# EAGLE board PWM_Board_77X (EAGLE 7.7.0), part 1 of 2
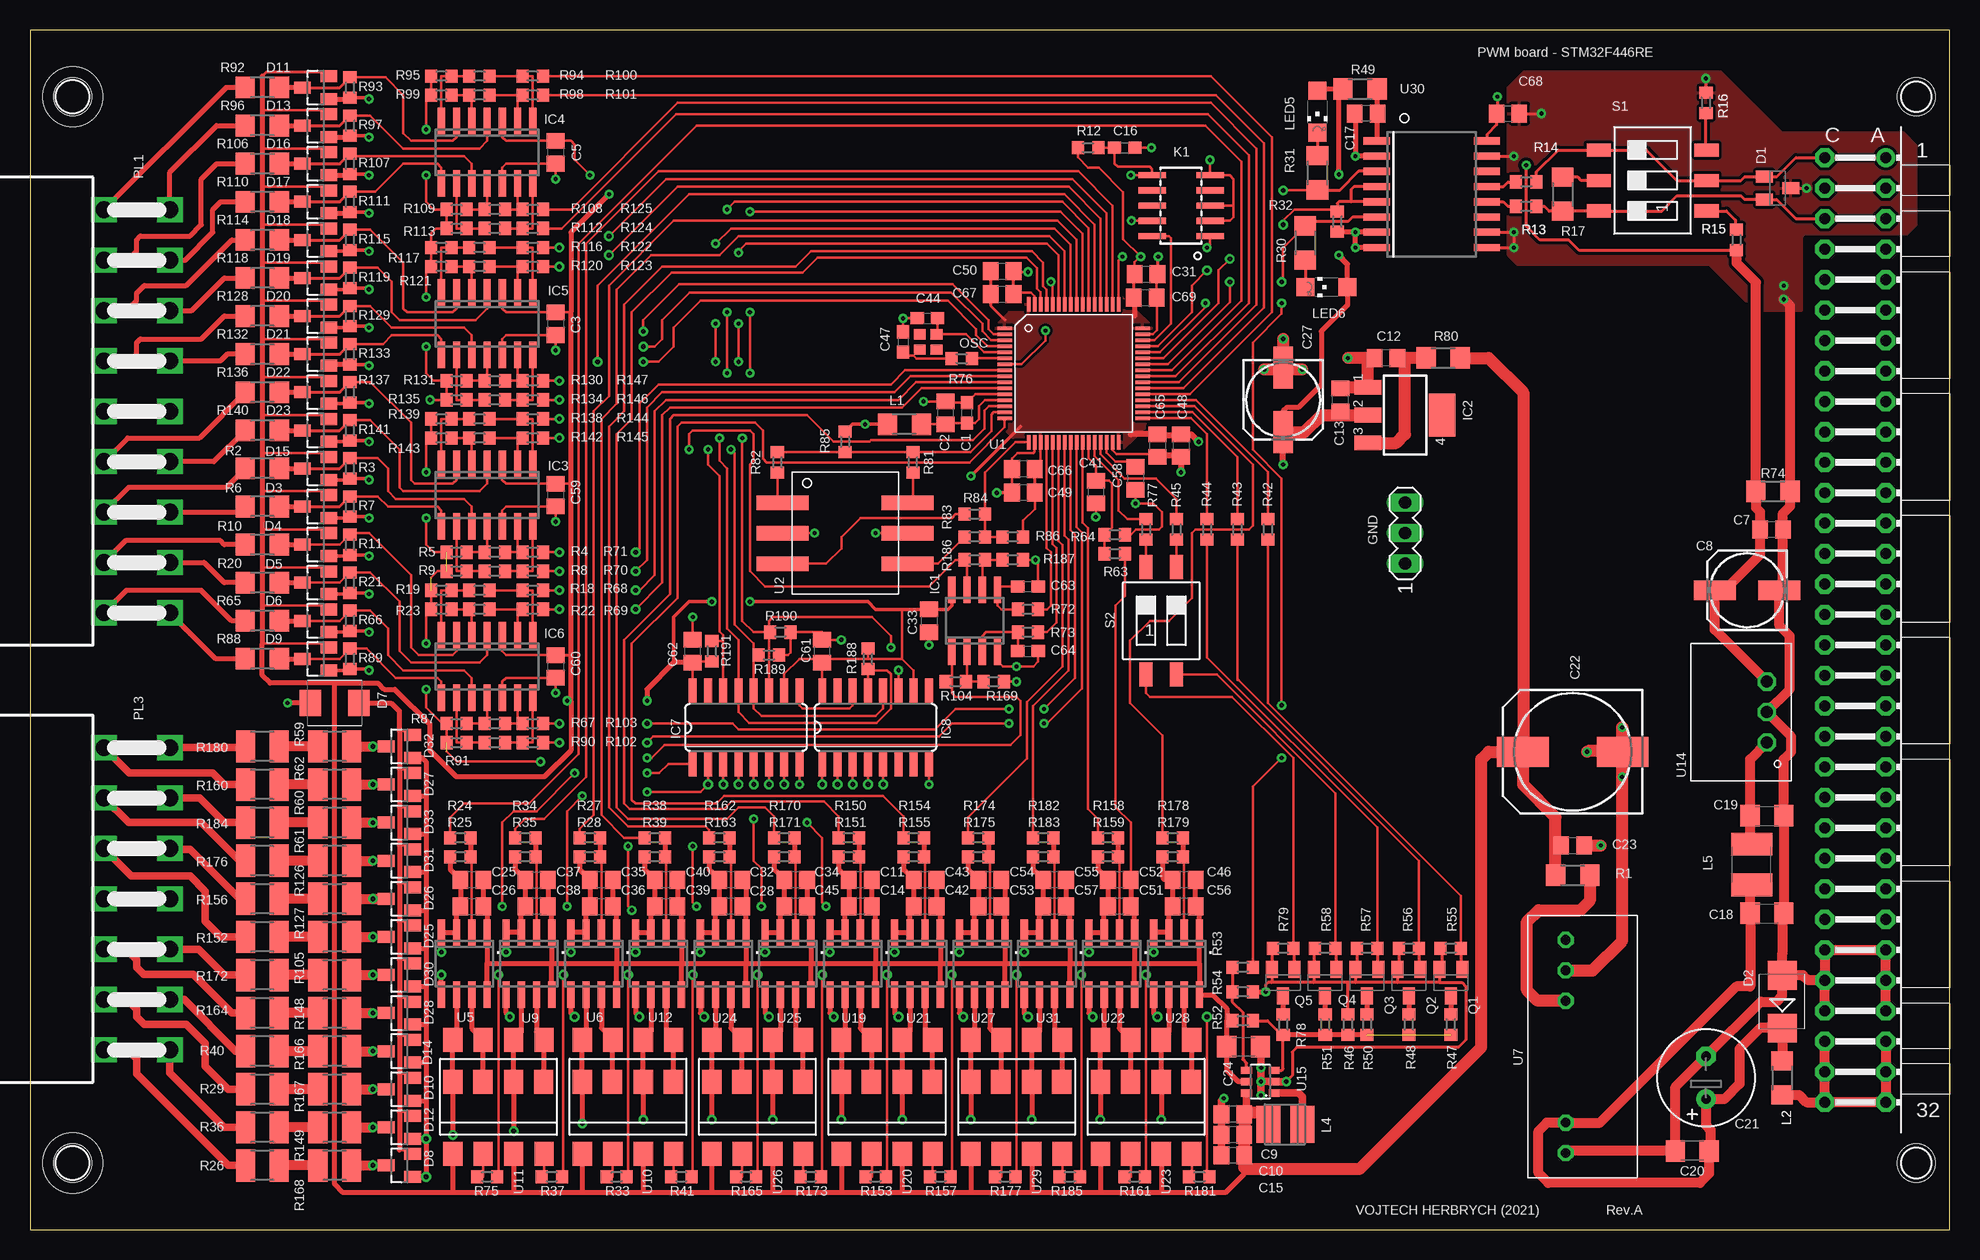
[diagram p8: board, top side]
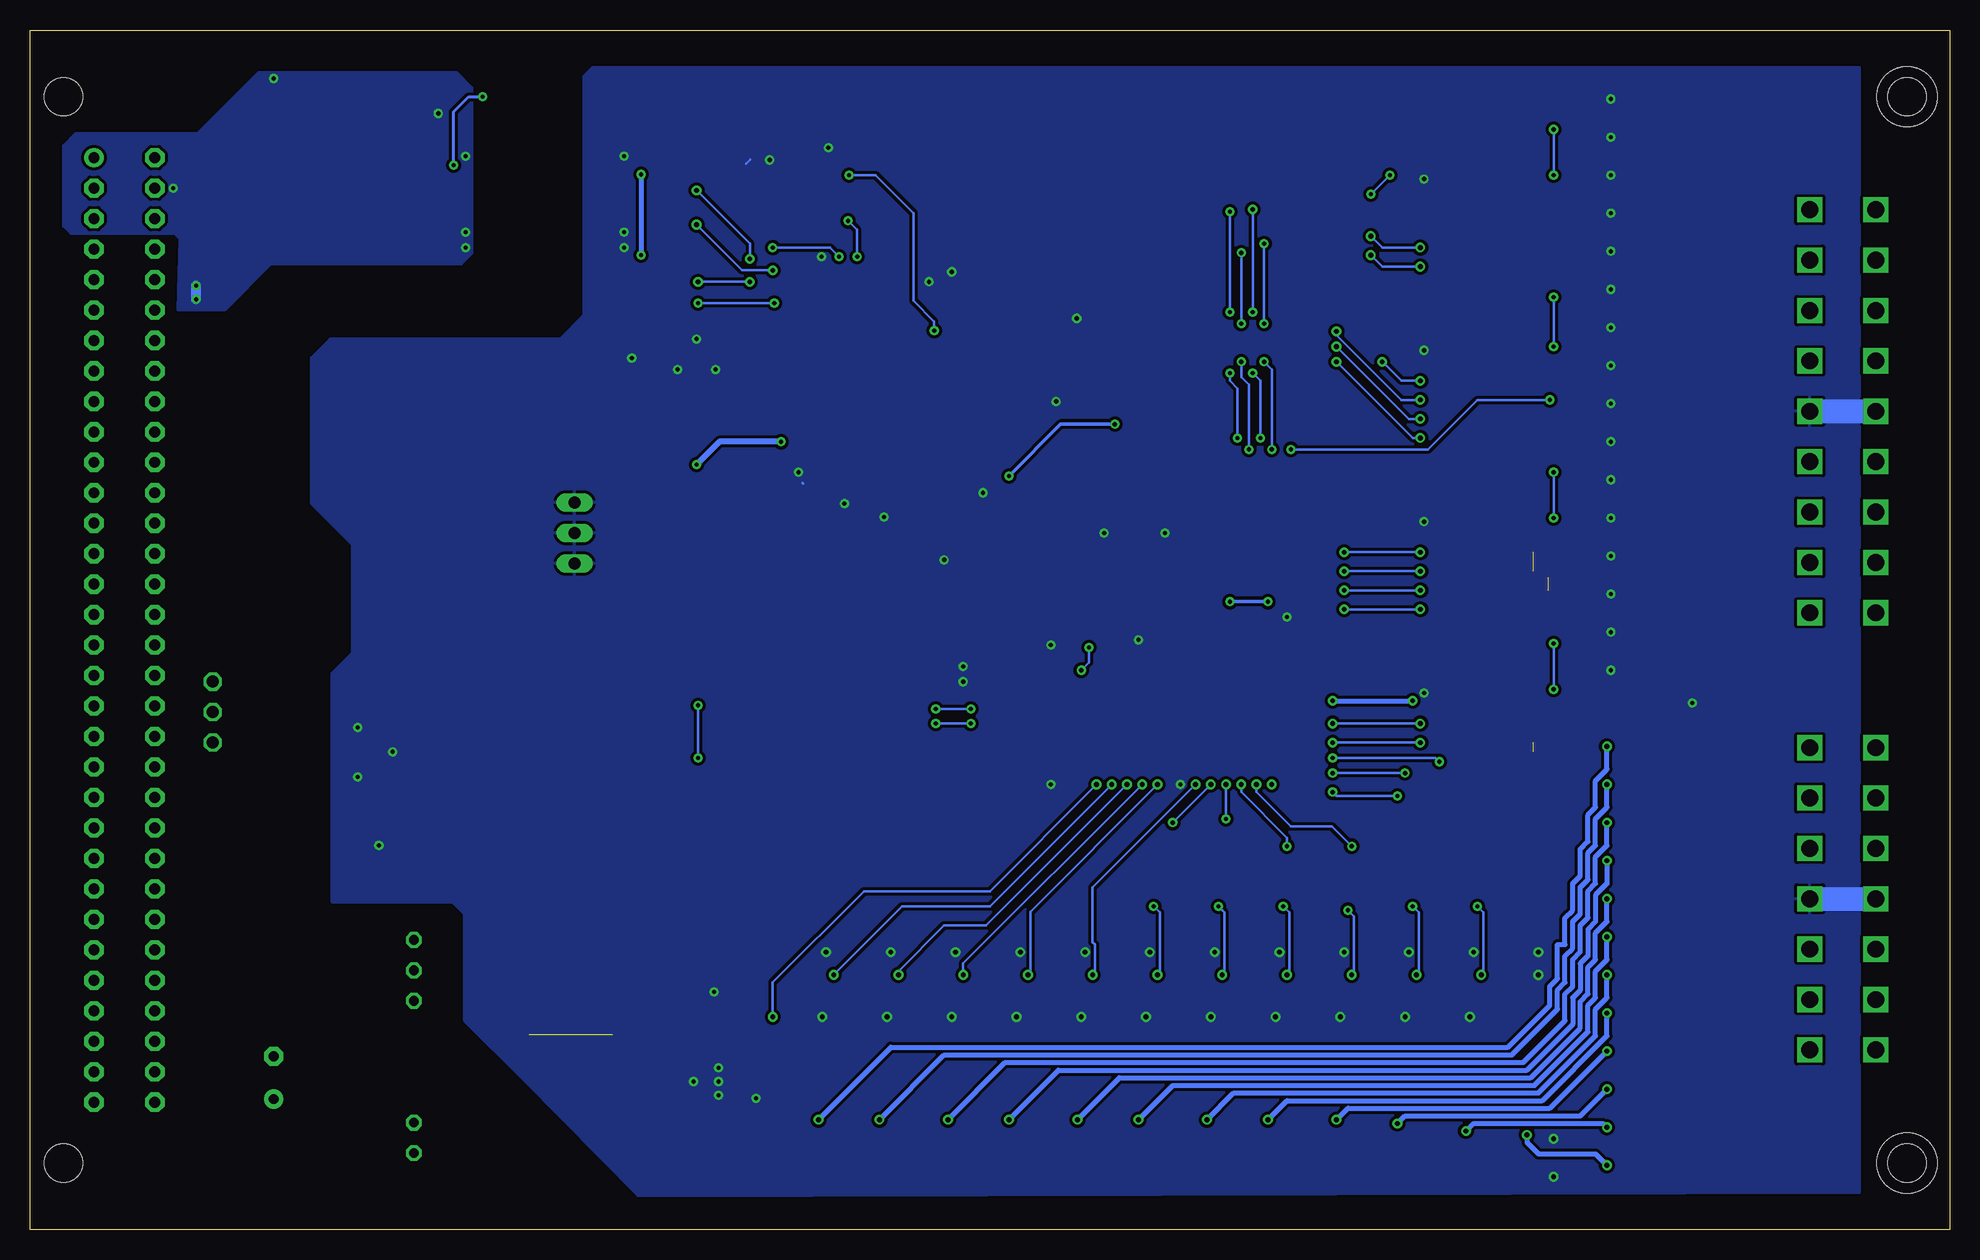
[diagram p9: board, bottom side, seen from below]

Size 160.02 x 100.03 mm. Coordinates in mm from the lower left corner, seen from the top.
Copper layers (1*16): Top 0.035mm / dielectric 1.5mm / Bottom 0.035mm
Design rules "default *": minimum track width 6mil, minimum drill 0.35mm, track to track 6mil, track to pad 6mil, pad to pad 6mil, via to via 6mil, smd to smd 6mil, copper to edge 40mil, drill to drill 6mil, minimum pad ring 10mil, minimum via ring 8mil, stop-mask expansion 4mil, vias tented up to drill 0mil, thermal gap 10mil
Holes 3.17 mm at 3.56,5.56 3.56,94.46 157.23,94.46 157.23,5.56
Holes 5 mm at 3.56,5.56 3.56,94.46
tRestrict: 15 lines
bRestrict: 15 lines

## Footprints (pad centres in the part's own frame; a part is rotated, then mirrored left to right if it is on the bottom)
C0603 = smd 1.1 x 1: 1 -0.85,0; 2 0.85,0
C0805 = smd 1.3 x 1.5: 1 -0.95,0; 2 0.95,0
153CLV-0605 = smd 3.5 x 1.6: + 2.7,0; - -2.7,0
C1206 = smd 1.6 x 1.8: 1 -1.4,0; 2 1.4,0
E3,5-8 = drill 0.813 pad 1.6: + -1.778,0 | drill 0.813 pad 1.6 octagon: - 1.778,0
150CLZ-1014 = smd 4.3 x 2.5: + 4.15,0; - -4.15,0
SOT23-BEC = smd 1 x 1.4: B -0.95,-1.1; C 0,1.1; E 0.95,-1.1
SMB = smd 2.4 x 2.4: A 2.2,0; C -2.2,0
SOT23 = smd 1 x 1.4: 1 -0.95,-1.1; 2 0.95,-1.1; 3 0,1.1
SMBJ = smd 1.78 x 2.16: A 2.04,0; C -2.03,0
MA03-1 = drill 1.016 long: 1 -2.54,0; 2 0,0; 3 2.54,0
SO8 = smd 0.6 x 2.2: 1 -1.905,-2.6; 2 -0.635,-2.6; 3 0.635,-2.6; 4 1.905,-2.6; 5 1.905,2.6; 6 0.635,2.6; 7 -0.635,2.6; 8 -1.905,2.6
SOT223 = smd 1.219 x 2.235: 1 -2.311,-3.099; 2 0,-3.099; 3 2.311,-3.099 | smd 3.6 x 2.2: 4 0,3.099
SO14 = smd 0.6 x 2.2: 1 -3.81,-2.6; 2 -2.54,-2.6; 3 -1.27,-2.6; 4 0,-2.6; 5 1.27,-2.6; 6 2.54,-2.6; 7 3.81,-2.6; 8 3.81,2.6; 9 2.54,2.6; 10 1.27,2.6; 11 0,2.6; 12 -1.27,2.6; 13 -2.54,2.6; 14 -3.81,2.6
SO16 = smd 0.66 x 2.032: 1 -4.445,-3.073; 2 -3.175,-3.073; 3 -1.905,-3.073; 4 -0.635,-3.073; 5 0.635,-3.073; 6 1.905,-3.073; 7 3.175,-3.073; 8 4.445,-3.073; 9 4.445,3.073; 10 3.175,3.073; 11 1.905,3.073; 12 0.635,3.073; 13 -0.635,3.073; 14 -1.905,3.073; 15 -3.175,3.073; 16 -4.445,3.073
SAMTECH_FTSH-105-01 = smd 0.508 x 2.286: 1 -2.54,-2.413; 2 -2.54,2.413; 3 -1.27,-2.413; 4 -1.27,2.413; 5 0,-2.413; 6 0,2.413; 7 1.27,-2.413; 8 1.27,2.413; 9 2.54,-2.413; 10 2.54,2.413
VG64P = drill 0.914 pad 1.6: A1 154.94,39.37 | drill 0.914 pad 1.6 octagon: A2 154.94,36.83; A3 154.94,34.29; A4 154.94,31.75; A5 154.94,29.21; A6 154.94,26.67; A7 154.94,24.13; A8 154.94,21.59; A9 154.94,19.05; A10 154.94,16.51; A11 154.94,13.97; A12 154.94,11.43; A13 154.94,8.89; A14 154.94,6.35; A15 154.94,3.81; A16 154.94,1.27; A17 154.94,-1.27; A18 154.94,-3.81; A19 154.94,-6.35; A20 154.94,-8.89; A21 154.94,-11.43; A22 154.94,-13.97; A23 154.94,-16.51; A24 154.94,-19.05; A25 154.94,-21.59; A26 154.94,-24.13; A27 154.94,-26.67; A28 154.94,-29.21; A29 154.94,-31.75; A30 154.94,-34.29; A31 154.94,-36.83; A32 154.94,-39.37; C1 149.86,39.37; C2 149.86,36.83; C3 149.86,34.29; C4 149.86,31.75; C5 149.86,29.21; C6 149.86,26.67; C7 149.86,24.13; C8 149.86,21.59; C9 149.86,19.05; C10 149.86,16.51; C11 149.86,13.97; C12 149.86,11.43; C13 149.86,8.89; C14 149.86,6.35; C15 149.86,3.81; C16 149.86,1.27; C17 149.86,-1.27; C18 149.86,-3.81; C19 149.86,-6.35; C20 149.86,-8.89; C21 149.86,-11.43; C22 149.86,-13.97; C23 149.86,-16.51; C24 149.86,-19.05; C25 149.86,-21.59; C26 149.86,-24.13; C27 149.86,-26.67; C28 149.86,-29.21; C29 149.86,-31.75; C30 149.86,-34.29; C31 149.86,-36.83; C32 149.86,-39.37
R1206 = smd 1.6 x 1.803: 1 -1.422,0; 2 1.422,0
IND_NPI43C = smd 2 x 3.07: 1 -1.365,0; 2 1.492,0
L1812 = smd 1.9 x 3.4: 1 -1.696,0; 2 1.696,0
CHIPLED_1206 = smd 1.5 x 1.5: A 0,-1.75; C 0,1.75
OSCILATOR = smd 0.965 x 0.864: 1 -0.762,-0.635; 2 0.635,-0.635; 3 0.635,0.635; 4 -0.762,0.635
5569-18_NO_HOLES = drill 1.4 square: 1 16.8,0; 2 12.6,0; 3 8.4,0; 4 4.2,0; 5 0,0; 6 -4.2,0; 7 -8.4,0; 8 -12.6,0; 9 -16.8,0; 10 16.8,5.5; 11 12.6,5.5; 12 8.4,5.5; 13 4.2,5.5; 14 0,5.5; 15 -4.2,5.5; 16 -8.4,5.5; 17 -12.6,5.5; 18 -16.8,5.5
5569-14_NO_HOLES = drill 1.4 square: 1 12.6,0; 2 8.4,0; 3 4.2,0; 4 0,0; 5 -4.2,0; 6 -8.4,0; 7 -12.6,0; 8 12.6,5.5; 9 8.4,5.5; 10 4.2,5.5; 11 0,5.5; 12 -4.2,5.5; 13 -8.4,5.5; 14 -12.6,5.5
R0603 = smd 1 x 1.1: 1 -0.85,0; 2 0.85,0
R1210 = smd 1.6 x 2.7: 1 -1.4,0; 2 1.4,0
SMS-003 = smd 1.092 x 2.007: 1 -2.54,-4.496; 2 0,-4.496; 3 2.54,-4.496; 4 2.54,4.496; 5 0,4.496; 6 -2.54,4.496
SMS-002 = smd 1.092 x 2.007: 1 -1.27,-4.496; 2 1.27,-4.496; 3 1.27,4.496; 4 -1.27,4.496
LQFP64_F446RE = smd 0.3 x 1.2: 1 -3.75,-5.75; 2 -3.25,-5.75; 3 -2.75,-5.75; 4 -2.25,-5.75; 5 -1.75,-5.75; 6 -1.25,-5.75; 7 -0.75,-5.75; 8 -0.25,-5.75; 9 0.25,-5.75; 10 0.75,-5.75; 11 1.25,-5.75; 12 1.75,-5.75; 13 2.25,-5.75; 14 2.75,-5.75; 15 3.25,-5.75; 16 3.75,-5.75; 33 3.75,5.75; 34 3.25,5.75; 35 2.75,5.75; 36 2.25,5.75; 37 1.75,5.75; 38 1.25,5.75; 39 0.75,5.75; 40 0.25,5.75; 41 -0.25,5.75; 42 -0.75,5.75; 43 -1.25,5.75; 44 -1.75,5.75; 45 -2.25,5.75; 46 -2.75,5.75; 47 -3.25,5.75; 48 -3.75,5.75 | smd 1.2 x 0.3: 17 5.75,-3.75; 18 5.75,-3.25; 19 5.75,-2.75; 20 5.75,-2.25; 21 5.75,-1.75; 22 5.75,-1.25; 23 5.75,-0.75; 24 5.75,-0.25; 25 5.75,0.25; 26 5.75,0.75; 27 5.75,1.25; 28 5.75,1.75; 29 5.75,2.25; 30 5.75,2.75; 31 5.75,3.25; 32 5.75,3.75; 49 -5.75,3.75; 50 -5.75,3.25; 51 -5.75,2.75; 52 -5.75,2.25; 53 -5.75,1.75; 54 -5.75,1.25; 55 -5.75,0.75; 56 -5.75,0.25; 57 -5.75,-0.25; 58 -5.75,-0.75; 59 -5.75,-1.25; 60 -5.75,-1.75; 61 -5.75,-2.25; 62 -5.75,-2.75; 63 -5.75,-3.25; 64 -5.75,-3.75
HEX_DEC = smd 1.219 x 4.318: 1 2.54,5.842; 2 -2.54,-4.572; 4 -2.54,5.842; 8 2.54,-4.572; C1 0,5.842; C2 0,-4.572
SO08 = smd 0.6 x 2.2: 1 -1.905,-2.6; 2 -0.635,-2.6; 3 0.635,-2.6; 4 1.905,-2.6; 5 1.905,2.6; 6 0.635,2.6; 7 -0.635,2.6; 8 -1.905,2.6
IU2405SA = drill 0.8 octagon: NC 10.541,0; VIN+ -4.699,0; VIN- -7.239,0; VOUT+ 5.461,0; VOUT- 8.001,0
DIL8-SMD_V2 = smd 1.6 x 2: 1 -3.81,-4.77; 2 -1.27,-4.77; 3 1.27,-4.77; 4 3.81,-4.77; 5 3.81,4.77; 6 1.27,4.77; 7 -1.27,4.77; 8 -3.81,4.77; 9 -3.81,1.27; 10 -1.31,1.27; 11 1.27,1.27; 12 3.77,1.27
R-78E-0.5 = drill 1 octagon: 1 -2.54,0; 2 0,0; 3 2.54,0
SOT23-6 = smd 0.6 x 0.9: 1 -0.95,-1.15; 2 0,-1.15; 3 0.95,-1.15; 4 0.95,1.15; 5 0,1.15; 6 -0.95,1.15
SO-16DW = smd 0.6 x 2.2: 1 -4.445,-4.6; 2 -3.175,-4.6; 3 -1.905,-4.6; 4 -0.635,-4.6; 5 0.635,-4.6; 6 1.905,-4.6; 7 3.175,-4.6; 8 4.445,-4.6; 9 4.445,4.6; 10 3.175,4.6; 11 1.905,4.6; 12 0.635,4.6; 13 -0.635,4.6; 14 -1.905,4.6; 15 -3.175,4.6; 16 -4.445,4.6

## Placement (x,y rotation side)
C1  220p  [C0603]  78.11,68.11 90 top
C2  1u  [C0805]  76.33,68.11 90 top
C3  100n  [C0805]  43.81,75.54 270 top
C5  100n  [C0805]  43.81,89.83 270 top
C7  100n  [C0805]  145.16,58.39 0 top
C8  100u  [153CLV-0605]  143.13,53.31 180 top
C9  1u/16V  [C0805]  100.27,9.63 180 top
C10  1u/16V  [C0805]  100.27,7.91 180 top
C11  100n  [C0805]  69.22,29.18 180 top
C12  100n  [C0805]  113.03,72.68 180 top
C13  100n  [C0805]  109.22,69.19 90 top
C14  100n  [C0805]  69.22,26.96 180 top
C15  1u/16V  [C0805]  100.27,6.2 180 top
C16  100n  [C0603]  91.25,90.21 0 top
C17  100n  [C0805]  111.38,93.07 180 top
C18  10u  [C1206]  144.78,26.39 0 top
C19  10u  [C1206]  144.78,34.52 0 top
C20  100n  [C1206]  138.56,6.58 180 top
C21  47u  [E3,5-8]  139.7,12.67 90 top
C22  47u  [150CLZ-1014]  128.59,39.85 180 top
C23  100n  [C0805]  128.59,32.04 0 top
C24  10u/50V  [C1206]  101.16,15.28 0 top
C25  100n  [C0805]  36.83,29.18 180 top
C26  100n  [C0805]  36.83,26.96 0 top
C27  100u  [153CLV-0605]  104.46,69.19 270 top
C28  100n  [C0805]  58.42,26.96 180 top
C31  1u  [C0805]  93.03,79.67 0 top
C32  100n  [C0805]  58.42,29.18 180 top
C33  100n  [C0805]  74.93,50.77 270 top
C34  100n  [C0805]  63.82,29.18 180 top
C35  100n  [C0805]  47.62,29.18 180 top
C36  100n  [C0805]  47.62,26.96 0 top
C37  100n  [C0805]  42.23,29.18 0 top
C38  100n  [C0805]  42.23,26.96 180 top
C39  100n  [C0805]  53.02,26.96 0 top
C40  100n  [C0805]  53.02,29.18 180 top
C41  100n  [C0805]  88.84,61.51 270 top
C42  100n  [C0805]  74.61,26.96 180 top
C43  100n  [C0805]  74.61,29.18 180 top
C44  10p  [C0603]  74.8,75.98 0 top
C45  100n  [C0805]  63.82,26.96 180 top
C46  100n  [C0805]  96.2,29.18 180 top
C47  10p  [C0603]  72.77,74.02 270 top
C48  1u  [C0805]  95.95,65.38 270 top
C49  1u  [C0805]  82.8,61.44 180 top
C50  1u  [C0805]  81.03,79.92 0 top
C51  100n  [C0805]  90.81,26.96 180 top
C52  100n  [C0805]  90.81,29.18 180 top
C53  100n  [C0805]  80.01,26.96 180 top
C54  100n  [C0805]  80.01,29.18 180 top
C55  100n  [C0805]  85.41,29.18 180 top
C56  100n  [C0805]  96.2,26.96 180 top
C57  100n  [C0805]  85.41,26.96 180 top
C58  4u7  [C0805]  92.14,62.65 270 top
C59  100n  [C0805]  43.81,61.25 270 top
C60  100n  [C0805]  43.81,46.96 270 top
C61  100n  [C0805]  66.04,48.23 90 top
C62  100n  [C0805]  55.24,48.23 90 top
C63  NC  [C0603]  83.19,53.63 0 top
C64  NC  [C0603]  83.19,48.23 0 top
C65  100n  [C0805]  93.98,65.38 270 top
C66  100n  [C0805]  82.8,63.41 180 top
C67  100n  [C0805]  81.03,78.02 0 top
C68  100n  [C0805]  123.19,93.07 0 top
C69  100n  [C0805]  92.96,77.7 0 top
D1  SM712-02HTG  [SOT23-BEC]  145.67,86.84 270 top
D2  SMBJ26A  [SMB]  146.05,19.02 90 top
D3  BAV199  [SOT23]  23.81,60.3 90 top
D4  BAV199  [SOT23]  23.81,57.12 90 top
D5  BAV199  [SOT23]  23.81,53.95 90 top
D6  BAV199  [SOT23]  23.81,50.77 90 top
D7  SMBJ24A  [SMBJ]  25.4,43.92 180 top
D8  BAV199  [SOT23]  30.8,5.37 90 top
D9  BAV199  [SOT23]  23.81,47.6 90 top
D10  BAV199  [SOT23]  30.8,11.72 90 top
D11  BAV199  [SOT23]  23.81,95.22 90 top
D12  BAV199  [SOT23]  30.8,8.55 90 top
D13  BAV199  [SOT23]  23.81,92.05 90 top
D14  BAV199  [SOT23]  30.8,14.9 90 top
D15  BAV199  [SOT23]  23.81,63.47 90 top
D16  BAV199  [SOT23]  23.81,88.87 90 top
D17  BAV199  [SOT23]  23.81,85.7 90 top
D18  BAV199  [SOT23]  23.81,82.52 90 top
D19  BAV199  [SOT23]  23.81,79.35 90 top
D20  BAV199  [SOT23]  23.81,76.17 90 top
D21  BAV199  [SOT23]  23.81,73 90 top
D22  BAV199  [SOT23]  23.81,69.82 90 top
D23  BAV199  [SOT23]  23.81,66.65 90 top
D25  BAV199  [SOT23]  30.8,24.42 90 top
D26  BAV199  [SOT23]  30.8,27.6 90 top
D27  BAV199  [SOT23]  30.8,37.12 90 top
D28  BAV199  [SOT23]  30.8,18.07 90 top
D30  BAV199  [SOT23]  30.8,21.25 90 top
D31  BAV199  [SOT23]  30.8,30.77 90 top
D32  BAV199  [SOT23]  30.8,40.3 90 top
D33  BAV199  [SOT23]  30.8,33.95 90 top
GND  [MA03-1]  114.62,58.08 90 top
IC1  MCP6002  [SO8]  78.74,50.77 0 top
IC2  LD1117  [SOT223]  114.62,67.92 270 top
IC3  TLC3704  [SO14]  38.1,61.25 180 top
IC4  TLC3704  [SO14]  38.1,89.83 180 top
IC5  TLC3704  [SO14]  38.1,75.54 180 top
IC6  TLC3704  [SO14]  38.1,46.96 180 top
IC7  74HCT595D  [SO16]  59.69,41.88 0 top
IC8  74HTC595D  [SO16]  70.48,41.88 0 top
K1  FTS-105-01-L-DV  [SAMTECH_FTSH-105-01]  95.95,85.38 90 top
K2  09 03 364 6921  [VG64P]  -0.25,50.01 0 top
L1  [R1206]  72.9,67.16 0 top
L2  LQM31PN1R0M00L  [R1206]  146.05,12.67 90 top
L4  SDR0302-120ML  [IND_NPI43C]  104.58,8.8 0 top
L5  1008PS-392KLB  [L1812]  143.51,30.45 90 top
LED5  1206  [CHIPLED_1206]  107.31,93.19 180 top
LED6  1206  [CHIPLED_1206]  108.08,78.59 90 top
OSC  Q22FA12800249  [OSCILATOR]  74.8,74.02 180 top
PL1  [5569-18_NO_HOLES]  6.16,68.24 270 top
PL3  [5569-14_NO_HOLES]  6.16,27.6 270 top
Q1  BC817  [SOT23-BEC]  118.43,20.61 180 top
Q2  BC817  [SOT23-BEC]  114.94,20.61 180 top
Q3  BC817  [SOT23-BEC]  111.44,20.61 180 top
Q4  BC817  [SOT23-BEC]  107.95,20.61 180 top
Q5  BC817  [SOT23-BEC]  104.46,20.61 180 top
R1  0R1  [R1206]  128.59,29.57 180 top
R2  10k  [R1206]  19.37,63.47 0 top
R3  2k58  [R0603]  26.67,63.47 90 top
R4  330k  [R0603]  38.73,56.49 180 top
R5  3k3  [R0603]  35.56,56.49 0 top
R6  10k  [R1206]  19.37,60.3 0 top
R7  2k58  [R0603]  26.67,60.3 90 top
R8  330k  [R0603]  38.73,54.9 180 top
R9  3k3  [R0603]  35.56,54.9 0 top
R10  10k  [R1206]  19.37,57.12 0 top
R11  2k58  [R0603]  26.67,57.12 90 top
R12  10k  [R0603]  88.2,90.21 180 top
R13  10R  [R0603]  124.71,85.32 180 top
R14  10R  [R0603]  124.71,87.35 180 top
R15  1k  [R0603]  142.24,82.52 270 top
R16  1k  [R0603]  139.7,93.95 270 top
R17  130R  [R1206]  127.76,86.33 90 top
R18  330k  [R0603]  37.47,53.31 180 top
R19  3k3  [R0603]  34.29,53.31 0 top
R20  10k  [R1206]  19.37,53.95 0 top
R21  2k58  [R0603]  26.67,53.95 90 top
R22  330k  [R0603]  37.47,51.73 180 top
R23  3k3  [R0603]  34.29,51.73 0 top
R24  10k  [R0603]  35.88,32.68 0 top
R25  100k  [R0603]  35.88,31.09 0 top
R26  330R  [R1210]  19.37,5.37 180 top
R27  10k  [R0603]  46.67,32.68 0 top
R28  100k  [R0603]  46.67,31.09 0 top
R29  330R  [R1210]  19.37,11.72 180 top
R30  1k5  [R1206]  106.3,82.27 90 top
R31  1k5  [R1206]  107.31,88.11 270 top
R32  10k  [R0603]  108.97,84.05 90 top
R33  680R  [R0603]  48.9,4.42 0 top
R34  10k  [R0603]  41.27,32.68 0 top
R35  100k  [R0603]  41.27,31.09 0 top
R36  330R  [R1210]  19.37,8.55 180 top
R37  680R  [R0603]  43.5,4.42 0 top
R38  10k  [R0603]  52.07,32.68 0 top
R39  100k  [R0603]  52.07,31.09 0 top
R40  330R  [R1210]  19.37,14.9 180 top
R41  680R  [R0603]  54.29,4.42 0 top
R42  10k  [R0603]  103.19,58.39 270 top
R43  10k  [R0603]  100.65,58.39 270 top
R44  10k  [R0603]  98.11,58.39 270 top
R45  10k  [R0603]  95.57,58.39 270 top
R46  240k  [R0603]  109.86,17.12 270 top
R47  120k  [R0603]  118.43,17.12 270 top
R48  60k  [R0603]  114.94,17.12 270 top
R49  0R1  [R1206]  110.87,95.1 180 top
R50  30k  [R0603]  111.44,17.12 270 top
R51  15k  [R0603]  107.95,17.12 270 top
R52  113k  [R0603]  101.09,17.44 180 top
R53  0R  [R0603]  101.09,21.88 0 top
R54  10k  [R0603]  101.09,19.85 0 top
R55  10k  [R0603]  118.43,23.47 180 top
R56  10k  [R0603]  114.94,23.47 180 top
R57  10k  [R0603]  111.44,23.47 180 top
R58  10k  [R0603]  107.95,23.47 180 top
R59  330R  [R1210]  25.4,40.3 180 top
R60  330R  [R1210]  25.4,33.95 180 top
R61  330R  [R1210]  25.4,30.77 180 top
R62  330R  [R1210]  25.4,37.12 180 top
R63  22k  [R0603]  90.42,56.36 0 top
R64  2k  [R0603]  90.42,57.95 180 top
R65  10k  [R1206]  19.37,50.77 0 top
R66  2k58  [R0603]  26.67,50.77 90 top
R67  330k  [R0603]  38.73,42.2 180 top
R68  0R  [R0603]  41.91,53.31 180 top
R69  0R  [R0603]  41.91,51.73 180 top
R70  0R  [R0603]  41.91,54.9 180 top
R71  0R  [R0603]  41.91,56.49 180 top
R72  0R  [R0603]  83.19,51.73 180 top
R73  0R  [R0603]  83.19,49.82 180 top
R74  470R  [R1206]  145.29,61.57 180 top
R75  680R  [R0603]  38.1,4.42 0 top
R76  390R  [R0603]  77.66,72.62 180 top
R77  10k  [R0603]  93.03,58.39 270 top
R78  7k5  [R0603]  104.46,17.12 270 top
R79  10k  [R0603]  104.46,23.47 180 top
R80  0R1  [R1206]  117.79,72.68 180 top
R81  20k  [R0603]  73.6,63.98 270 top
R82  10k  [R0603]  62.29,63.98 270 top
R83  20k  [R0603]  78.74,57.76 180 top
R84  10k  [R0603]  78.74,59.66 180 top
R85  10k  [R0603]  67.94,65.7 270 top
R86  10k  [R0603]  81.92,57.76 180 top
R87  3k3  [R0603]  35.56,42.2 0 top
R88  10k  [R1206]  19.37,47.6 0 top
R89  2k58  [R0603]  26.67,47.6 90 top
R90  330k  [R0603]  38.73,40.61 180 top
R91  3k3  [R0603]  35.56,40.61 0 top
R92  10k  [R1206]  19.37,95.22 0 top
R93  2k58  [R0603]  26.67,95.22 90 top
R94  330k  [R0603]  37.47,96.18 180 top
R95  3k3  [R0603]  34.29,96.18 0 top
R96  10k  [R1206]  19.37,92.05 0 top
R97  2k58  [R0603]  26.67,92.05 90 top
R98  330k  [R0603]  37.47,94.59 180 top
R99  3k3  [R0603]  34.29,94.59 0 top
R100  0R  [R0603]  41.91,96.18 180 top
R101  0R  [R0603]  41.91,94.59 180 top
R102  0R  [R0603]  41.91,40.61 180 top
R103  0R  [R0603]  41.91,42.2 180 top
R104  0R  [R0603]  77.15,45.69 180 top
R105  330R  [R1210]  25.4,21.25 180 top
R106  10k  [R1206]  19.37,88.87 0 top
R107  2k58  [R0603]  26.67,88.87 90 top
R108  330k  [R0603]  38.73,85.06 180 top
R109  3k3  [R0603]  35.56,85.06 0 top
R110  10k  [R1206]  19.37,85.7 0 top
R111  2k58  [R0603]  26.67,85.7 90 top
R112  330k  [R0603]  38.73,83.48 180 top
R113  3k3  [R0603]  35.56,83.48 0 top
R114  10k  [R1206]  19.37,82.52 0 top
R115  2k58  [R0603]  26.67,82.52 90 top
R116  330k  [R0603]  37.47,81.89 180 top
R117  3k3  [R0603]  34.29,81.89 0 top
R118  10k  [R1206]  19.37,79.35 0 top
R119  2k58  [R0603]  26.67,79.35 90 top
R120  330k  [R0603]  37.47,80.3 180 top
R121  3k3  [R0603]  34.29,80.3 0 top
R122  0R  [R0603]  41.91,81.89 180 top
R123  0R  [R0603]  41.91,80.3 180 top
R124  0R  [R0603]  41.91,83.48 180 top
R125  0R  [R0603]  41.91,85.06 180 top
R126  330R  [R1210]  25.4,27.6 180 top
R127  330R  [R1210]  25.4,24.42 180 top
R128  10k  [R1206]  19.37,76.17 0 top
R129  2k58  [R0603]  26.67,76.17 90 top
R130  330k  [R0603]  38.73,70.78 180 top
R131  3k3  [R0603]  35.56,70.78 0 top
R132  10k  [R1206]  19.37,73 0 top
R133  2k58  [R0603]  26.67,73 90 top
R134  330k  [R0603]  38.73,69.19 180 top
R135  3k3  [R0603]  35.56,69.19 0 top
R136  10k  [R1206]  19.37,69.82 0 top
R137  2k58  [R0603]  26.67,69.82 90 top
R138  330k  [R0603]  37.47,67.6 180 top
R139  3k3  [R0603]  34.29,67.6 0 top
R140  10k  [R1206]  19.37,66.65 0 top
R141  2k58  [R0603]  26.67,66.65 90 top
R142  330k  [R0603]  37.47,66.01 180 top
R143  3k3  [R0603]  34.29,66.01 0 top
R144  0R  [R0603]  41.91,67.6 180 top
R145  0R  [R0603]  41.91,66.01 180 top
R146  0R  [R0603]  41.91,69.19 180 top
R147  0R  [R0603]  41.91,70.78 180 top
R148  330R  [R1210]  25.4,18.07 180 top
R149  330R  [R1210]  25.4,8.55 180 top
R150  10k  [R0603]  68.26,32.68 0 top
R151  100k  [R0603]  68.26,31.09 0 top
R152  330R  [R1210]  19.37,24.42 180 top
R153  680R  [R0603]  70.48,4.42 0 top
R154  10k  [R0603]  73.66,32.68 0 top
R155  100k  [R0603]  73.66,31.09 0 top
R156  330R  [R1210]  19.37,27.6 180 top
R157  680R  [R0603]  75.88,4.42 0 top
R158  10k  [R0603]  89.85,32.68 0 top
R159  100k  [R0603]  89.85,31.09 0 top
R160  330R  [R1210]  19.37,37.12 180 top
R161  680R  [R0603]  92.08,4.42 0 top
R162  10k  [R0603]  57.47,32.68 0 top
R163  100k  [R0603]  57.47,31.09 0 top
R164  330R  [R1210]  19.37,18.07 180 top
R165  680R  [R0603]  59.69,4.42 0 top
R166  330R  [R1210]  25.4,14.9 180 top
R167  330R  [R1210]  25.4,11.72 180 top
R168  330R  [R1210]  25.4,5.37 180 top
R169  NF  [R0603]  80.33,45.69 180 top
R170  10k  [R0603]  62.87,32.68 0 top
R171  100k  [R0603]  62.87,31.09 0 top
R172  330R  [R1210]  19.37,21.25 180 top
R173  680R  [R0603]  65.09,4.42 0 top
R174  10k  [R0603]  79.06,32.68 0 top
R175  100k  [R0603]  79.06,31.09 0 top
R176  330R  [R1210]  19.37,30.77 180 top
R177  680R  [R0603]  81.28,4.42 0 top
R178  10k  [R0603]  95.25,32.68 0 top
R179  100k  [R0603]  95.25,31.09 0 top
R180  330R  [R1210]  19.37,40.3 180 top
R181  680R  [R0603]  97.47,4.42 0 top
R182  10k  [R0603]  84.45,32.68 0 top
R183  100k  [R0603]  84.45,31.09 0 top
R184  330R  [R1210]  19.37,33.95 180 top
R185  680R  [R0603]  86.68,4.42 0 top
R186  0R  [R0603]  78.74,55.85 180 top
R187  NF  [R0603]  81.92,55.85 180 top
R188  10k  [R0603]  69.85,47.6 90 top
R189  10k  [R0603]  61.59,47.92 0 top
R190  10k  [R0603]  62.55,49.82 0 top
R191  10k  [R0603]  56.83,48.23 270 top
S1  SWS003  [SMS-003]  135.25,87.48 90 top
S2  SWS002  [SMS-002]  94.3,50.77 0 top
U1  STM32F446RE_64PIN  [LQFP64_F446RE]  87,71.41 270 top
U2  SH-7050TB  [HEX_DEC]  68.58,58.08 90 top
U5  TC4432  [SO08]  36.2,22.2 180 top
U6  TC4432  [SO08]  46.99,22.2 180 top
U7  IU2405SA  [IU2405SA]  128.02,13.63 90 top
U9  TC4432  [SO08]  41.59,22.2 180 top
U10  TLP222A-2  [DIL8-SMD_V2]  49.85,11.09 0 top
U11  TLP222A-2  [DIL8-SMD_V2]  39.05,11.09 0 top
U12  TC4432  [SO08]  52.39,22.2 180 top
U14  R-78C5.0-0.5  [R-78E-0.5]  144.78,43.15 90 top
U15  TLV61046A  [SOT23-6]  102.55,12.36 90 top
U19  TC4432  [SO08]  68.58,22.2 180 top
U20  TLP222A-2  [DIL8-SMD_V2]  71.44,11.09 0 top
U21  TC4432  [SO08]  73.98,22.2 180 top
U22  TC4432  [SO08]  90.17,22.2 180 top
U23  TLP222A-2  [DIL8-SMD_V2]  93.03,11.09 0 top
U24  TC4432  [SO08]  57.78,22.2 180 top
U25  TC4432  [SO08]  63.18,22.2 180 top
U26  TLP222A-2  [DIL8-SMD_V2]  60.64,11.09 0 top
U27  TC4432  [SO08]  79.38,22.2 180 top
U28  TC4432  [SO08]  95.57,22.2 180 top
U29  TLP222A-2  [DIL8-SMD_V2]  82.23,11.09 0 top
U30  ISO3082  [SO-16DW]  116.84,86.33 270 top
U31  TC4432  [SO08]  84.77,22.2 180 top